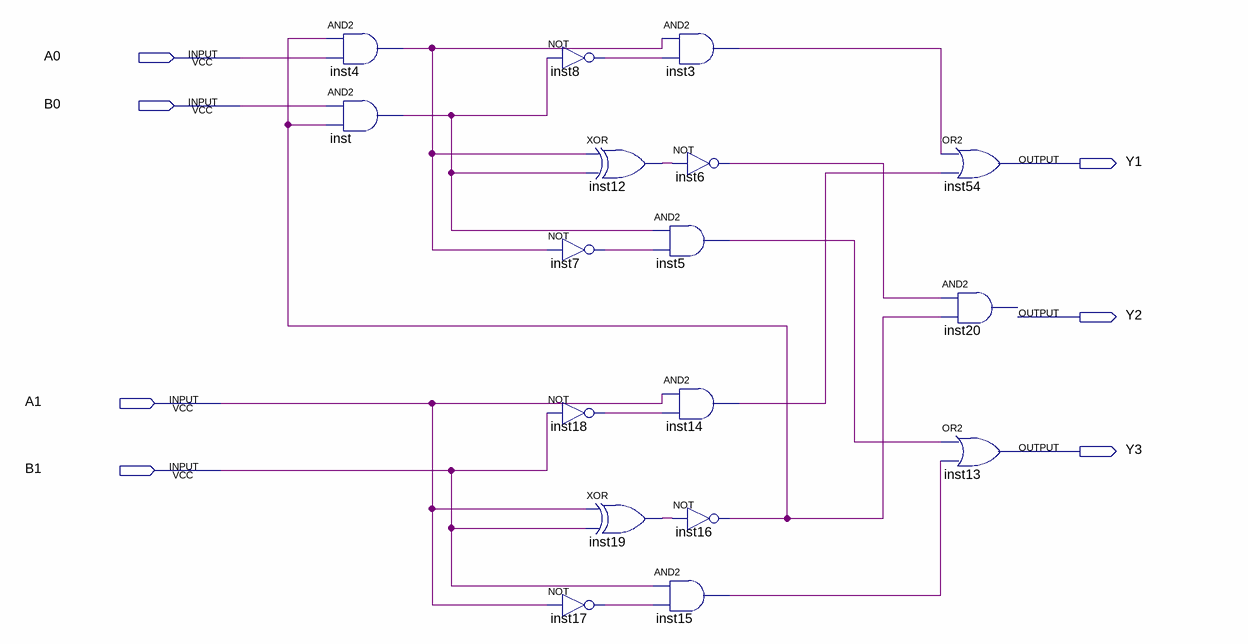
[diagram p0: schematic sheet]
// Quartus schematic semana4proj2.bdf as structural Verilog: 17 symbols, 7 pins
module semana4proj2 (
  input  A0,
  input  B0,
  input  A1,
  input  B1,
  output Y1,
  output Y2,
  output Y3
);

  wire inst3_out, inst4_out, inst5_out, inst6_out, inst7_out, inst8_out, inst12_out, inst14_out, inst15_out,
       inst16_out, inst17_out, inst18_out, inst19_out, inst_out;

  and inst4 (inst4_out, inst16_out, A0);
  and inst (inst_out, B0, inst16_out);
  not inst8 (inst8_out, inst_out);
  not inst7 (inst7_out, inst4_out);
  not inst18 (inst18_out, B1);
  not inst17 (inst17_out, A1);
  xor inst12 (inst12_out, inst4_out, inst_out);
  xor inst19 (inst19_out, A1, B1);
  and inst3 (inst3_out, inst4_out, inst8_out);
  not inst6 (inst6_out, inst12_out);
  and inst5 (inst5_out, inst_out, inst7_out);
  and inst14 (inst14_out, A1, inst18_out);
  not inst16 (inst16_out, inst19_out);
  and inst15 (inst15_out, B1, inst17_out);
  or inst54 (Y1, inst3_out, inst14_out);
  // AND2 inst20 has open pins: IN1=inst6_out, IN2=inst16_out, OUT=open
  or inst13 (Y3, inst5_out, inst15_out);
endmodule
